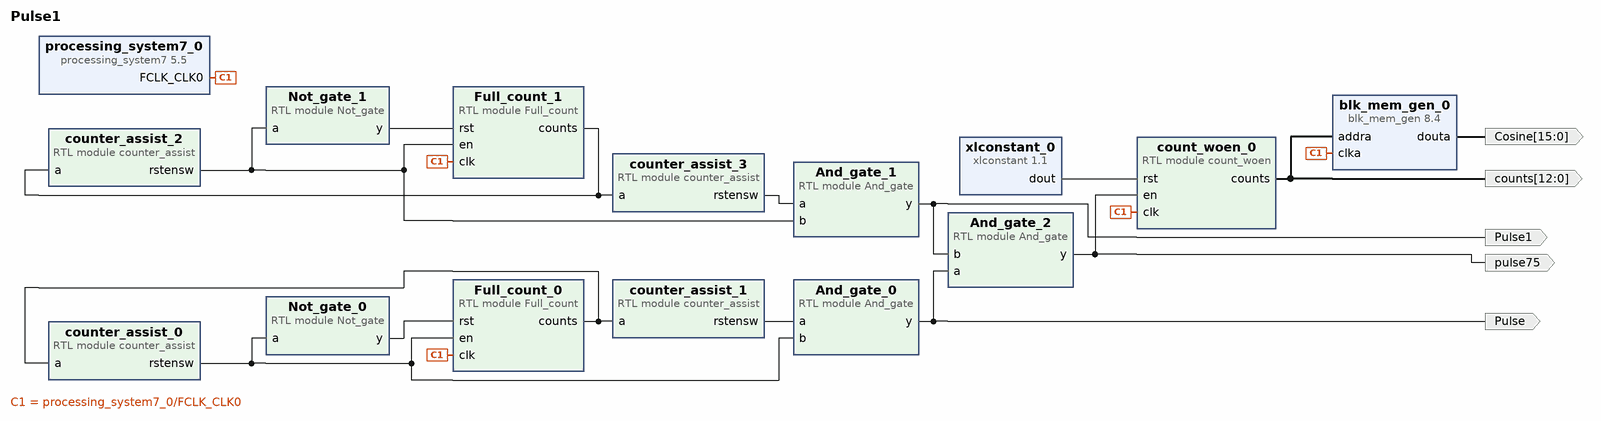
[diagram p0: block diagram of the top level]
# Vivado block design Pulse1, xc7z035ifbg676-2L, Vivado 2021.1
create_bd_design Pulse1

create_bd_port -dir O Pulse1
create_bd_port -dir O Pulse
create_bd_port -dir O pulse75
create_bd_port -dir O -from 12 -to 0 counts
create_bd_port -dir O -from 15 -to 0 Cosine

create_bd_cell -type module -reference And_gate And_gate_0
create_bd_cell -type module -reference Full_count Full_count_0
create_bd_cell -type module -reference Not_gate Not_gate_0
create_bd_cell -type module -reference counter_assist counter_assist_0
set_property -dict {CONFIG.target 1199} [get_bd_cells counter_assist_0]
create_bd_cell -type ip -vlnv xilinx.com:ip:processing_system7:5.5 processing_system7_0
set_property -dict [list \
  CONFIG.PCW_EN_RST0_PORT 0 \
  CONFIG.PCW_FPGA0_PERIPHERAL_FREQMHZ 100 \
  CONFIG.PCW_UIPARAM_DDR_ENABLE 0 \
  CONFIG.PCW_USE_M_AXI_GP0 0 \
] [get_bd_cells processing_system7_0]
# 30 more settings of processing_system7_0 are not shown: defaults, MIO pin electricals, DDR timing, and values the tool derives
create_bd_cell -type module -reference counter_assist counter_assist_1
set_property -dict {CONFIG.target 700} [get_bd_cells counter_assist_1]
create_bd_cell -type module -reference And_gate And_gate_1
create_bd_cell -type module -reference Full_count Full_count_1
create_bd_cell -type module -reference Not_gate Not_gate_1
create_bd_cell -type module -reference counter_assist counter_assist_2
set_property -dict {CONFIG.target 8399} [get_bd_cells counter_assist_2]
create_bd_cell -type module -reference counter_assist counter_assist_3
set_property -dict {CONFIG.target 1900} [get_bd_cells counter_assist_3]
create_bd_cell -type module -reference count_woen count_woen_0
create_bd_cell -type module -reference And_gate And_gate_2
create_bd_cell -type ip -vlnv xilinx.com:ip:xlconstant:1.1 xlconstant_0
set_property -dict {CONFIG.CONST_VAL 0} [get_bd_cells xlconstant_0]
create_bd_cell -type ip -vlnv xilinx.com:ip:blk_mem_gen:8.4 blk_mem_gen_0
set_property -dict [list \
  CONFIG.Coe_File ../../../../../../../../Cosine.txt.coe \
  CONFIG.Enable_32bit_Address false \
  CONFIG.Enable_A Always_Enabled \
  CONFIG.Load_Init_File true \
  CONFIG.Memory_Type Single_Port_ROM \
  CONFIG.Port_A_Write_Rate 0 \
  CONFIG.Register_PortA_Output_of_Memory_Primitives true \
  CONFIG.Use_RSTA_Pin false \
  CONFIG.Write_Width_A 16 \
  CONFIG.use_bram_block Stand_Alone \
] [get_bd_cells blk_mem_gen_0]

# ---- connections ----

connect_bd_net [get_bd_pins And_gate_0/y] [get_bd_ports Pulse] [get_bd_pins And_gate_2/a]
connect_bd_net -net And_gate_0_y1 [get_bd_pins And_gate_1/y] [get_bd_ports Pulse1] [get_bd_pins And_gate_2/b]
connect_bd_net [get_bd_pins And_gate_2/y] [get_bd_pins count_woen_0/en] [get_bd_ports pulse75]
connect_bd_net [get_bd_pins Full_count_0/counts] [get_bd_pins counter_assist_0/a] [get_bd_pins counter_assist_1/a]
connect_bd_net -net Full_count_0_counts1 [get_bd_pins Full_count_1/counts] [get_bd_pins counter_assist_2/a] [get_bd_pins counter_assist_3/a]
connect_bd_net [get_bd_pins Not_gate_0/y] [get_bd_pins Full_count_0/rst]
connect_bd_net -net Not_gate_0_y1 [get_bd_pins Not_gate_1/y] [get_bd_pins Full_count_1/rst]
connect_bd_net [get_bd_pins blk_mem_gen_0/douta] [get_bd_ports Cosine]
connect_bd_net [get_bd_pins count_woen_0/counts] [get_bd_ports counts] [get_bd_pins blk_mem_gen_0/addra]
connect_bd_net [get_bd_pins counter_assist_0/rstensw] [get_bd_pins Full_count_0/en] [get_bd_pins Not_gate_0/a] [get_bd_pins And_gate_0/b]
connect_bd_net -net counter_assist_0_rstensw1 [get_bd_pins counter_assist_2/rstensw] \
  [get_bd_pins Full_count_1/en] [get_bd_pins Not_gate_1/a] [get_bd_pins And_gate_1/b]
connect_bd_net [get_bd_pins counter_assist_1/rstensw] [get_bd_pins And_gate_0/a]
connect_bd_net -net counter_assist_1_rstensw1 [get_bd_pins counter_assist_3/rstensw] [get_bd_pins And_gate_1/a]
connect_bd_net [get_bd_pins processing_system7_0/FCLK_CLK0] \
  [get_bd_pins Full_count_0/clk] [get_bd_pins Full_count_1/clk] [get_bd_pins count_woen_0/clk] \
  [get_bd_pins blk_mem_gen_0/clka]
connect_bd_net [get_bd_pins xlconstant_0/dout] [get_bd_pins count_woen_0/rst]

validate_bd_design
save_bd_design
